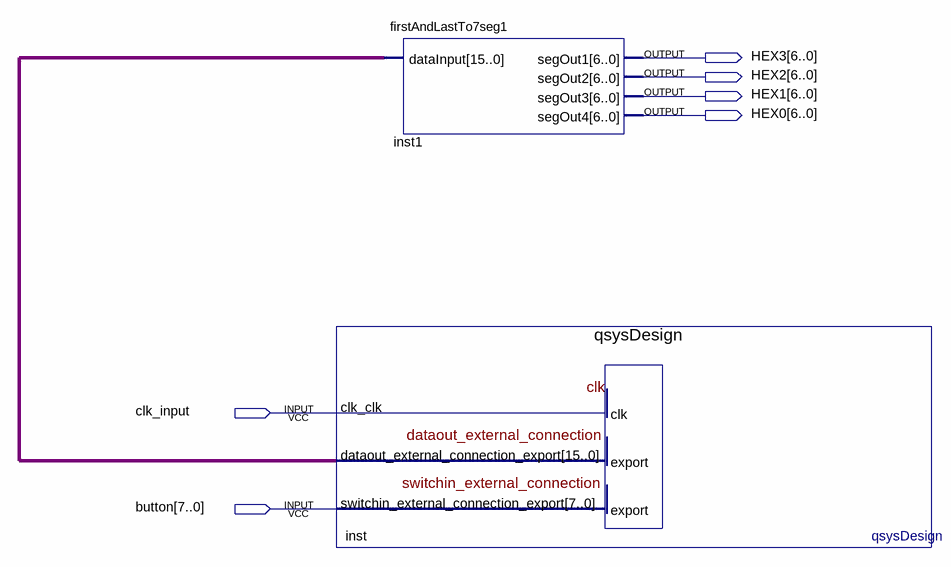
[diagram p0: schematic sheet]
// Quartus schematic blockfile.bdf as structural Verilog: 2 symbols, 6 pins
module blockfile (
  input  clk_input,
  input  [7:0] button,
  output [6:0] HEX3,
  output [6:0] HEX2,
  output [6:0] HEX1,
  output [6:0] HEX0
);

  wire [15:0] inst_dataout_external_connection_export;

  qsysDesign inst (
    .clk_clk(clk_input), .switchin_external_connection_export(button),
    .dataout_external_connection_export(inst_dataout_external_connection_export));
  firstAndLastTo7seg1 inst1 (
    .dataInput(inst_dataout_external_connection_export), .segOut1(HEX3), .segOut2(HEX2), .segOut3(HEX1),
    .segOut4(HEX0));
endmodule
